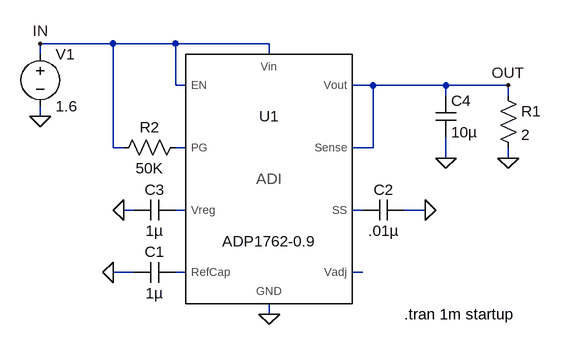
[diagram p0: schematic ADP1762-0.9.asc]
ADP1762-0.9.asc, the LTspice schematic file:
Version 4
SHEET 1 880 680
WIRE -16 -32 -128 -32
WIRE 80 -32 -16 -32
WIRE 224 -32 80 -32
WIRE -128 -16 -128 -32
WIRE 224 -16 224 -32
WIRE 80 32 80 -32
WIRE 96 32 80 32
WIRE 384 32 352 32
WIRE 496 32 384 32
WIRE 592 32 496 32
WIRE 496 48 496 32
WIRE 592 48 592 32
WIRE -128 80 -128 64
WIRE -16 128 -16 -32
WIRE 0 128 -16 128
WIRE 96 128 80 128
WIRE 384 128 384 32
WIRE 384 128 352 128
WIRE 496 144 496 112
WIRE 592 144 592 128
WIRE 16 224 0 224
WIRE 96 224 80 224
WIRE 368 224 352 224
WIRE 464 224 432 224
WIRE 16 320 -16 320
WIRE 96 320 80 320
WIRE 368 320 352 320
WIRE 224 384 224 368
FLAG 224 384 0
FLAG -128 80 0
FLAG -16 320 0
FLAG 0 224 0
FLAG 464 224 0
FLAG 592 144 0
FLAG 496 144 0
FLAG -128 -32 IN
FLAG 592 32 OUT
SYMBOL cap 80 304 R90
WINDOW 0 0 32 VBottom 2
WINDOW 3 32 32 VTop 2
SYMATTR InstName C1
SYMATTR Value 1µ
SYMBOL cap 432 208 R90
WINDOW 0 0 32 VBottom 2
WINDOW 3 32 32 VTop 2
SYMATTR InstName C2
SYMATTR Value .01µ
SYMBOL voltage -128 -32 R0
SYMATTR InstName V1
SYMATTR Value 1.6
SYMBOL res 96 112 R90
WINDOW 0 0 56 VBottom 2
WINDOW 3 32 56 VTop 2
SYMATTR InstName R2
SYMATTR Value 50K
SYMBOL cap 80 208 R90
WINDOW 0 0 32 VBottom 2
WINDOW 3 32 32 VTop 2
SYMATTR InstName C3
SYMATTR Value 1µ
SYMBOL res 576 32 R0
SYMATTR InstName R1
SYMATTR Value 2
SYMBOL cap 480 48 R0
SYMATTR InstName C4
SYMATTR Value 10µ
SYMBOL PowerProducts\\ADP1762-0.9 224 176 R0
SYMATTR InstName U1
TEXT 432 384 Left 2 !.tran 1m startup

The netlist it stands for:
* ADP1762-0.9.asc
C1 N004 0 1µ
C2 0 N003 .01µ
V1 IN 0 1.6
R2 N001 IN 50K
C3 N002 0 1µ
R1 OUT 0 2
C4 OUT 0 10µ
XU1 N002 IN IN OUT OUT N001 0 N003 N004 N005 ADP1762 Radj=6K m=1  ; pins Vreg Vin EN Vout Sense PG GND SS RefCap Vadj
.tran 1m startup
.lib ADP1762.sub
.backanno
.end